# EAGLE design Reflow_triac_page1 (EAGLE 6.5.0)
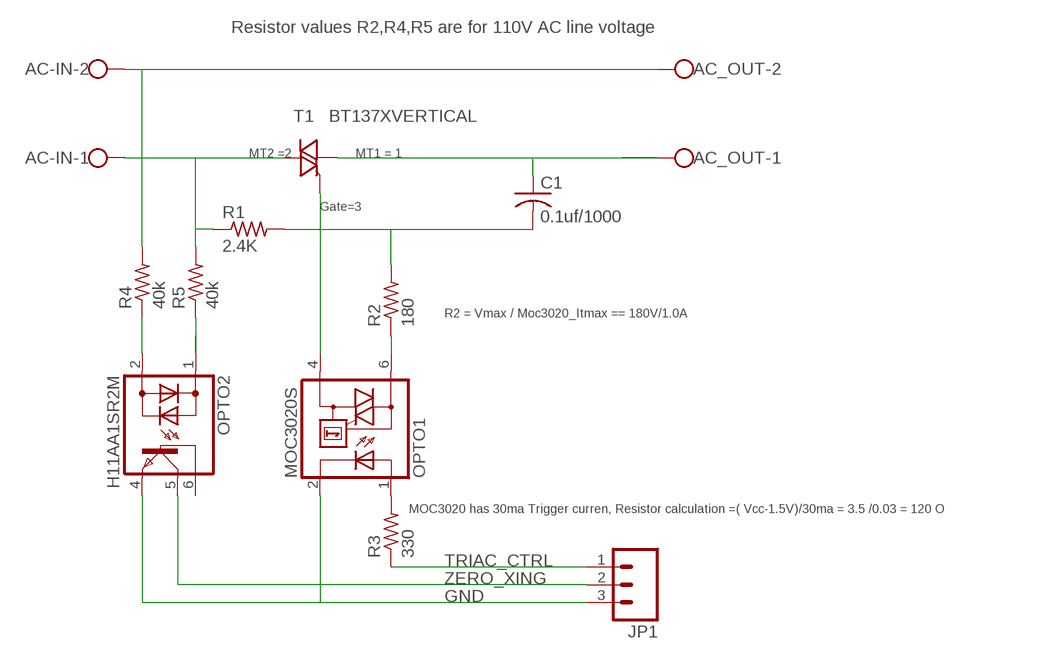
[diagram p0: schematic, sheet 1]

## Parts
AC-IN  W237-102  [W237-102]
AC_OUT  W237-102  [W237-102]
C1  0.1uf/1000  C-US102_152-062X184  [C102_152-062X184]
JP1  M03PTH  [1X03]
OPTO1  MOC3020S  MOC30MSMD  [DIL6-SMD]
OPTO2  H11AA1SR2M  IL250SMD  [DIL6-SMD]
R1  2.4K  R-US_0207/10  [0207/10]
R2  180  R-US_0207/10  [0207/10]
R3  330  R-US_0207/10  [0207/10]
R4  40k  R-US_0207/10  [0207/10]
R5  40k  R-US_0207/10  [0207/10]
T1  BT137XVERTICAL  [TO220DS]

## Nets
GND: JP1.3 OPTO1.2(C) OPTO2.4(E)
N$1: AC-IN.1 R1.1 R5.2 T1.A2
N$2: AC_OUT.1 C1.1 T1.A1
N$3: OPTO1.4(A1) T1.G
N$4: C1.2 R1.2 R2.2
N$5: OPTO1.6(A2) R2.1
N$6: OPTO1.1(A) R3.2
N$7: OPTO2.2(AC2) R4.1
N$8: AC-IN.2 AC_OUT.2 R4.2
N$9: OPTO2.1(AC1) R5.1
TRIAC_CTRL: JP1.1 R3.1
ZERO_XING: JP1.2 OPTO2.5(C)
Unconnected: OPTO2.6(B)

## Notes on the sheet
- Resistor values R2,R4,R5 are for 110V AC line voltage
- MT2 =2 | MT1 = 1
- Gate=3
- R2 = Vmax / Moc3020_Itmax == 180V/1.0A
- MOC3020 has 30ma Trigger curren, Resistor calculation =( Vcc-1.5V)/30ma = 3.5 /0.03 = 120 O

## Library data of the parts
AC-IN AC_OUT = con-wago-500:W237-102: WAGO SCREW CLAMP; MPN: 237-102; OC_FARNELL: unknown; OC_NEWARK: 70K9898
C1 = rcl:C-US: CAPACITOR, American symbol
JP1 = SparkFun-Connectors:M03: Header 3 Standard 3-pin 0.1" header. Use with straight break away headers (SKU : PRT-00116), right angle break away headers (PRT-00553), swiss pins (PRT-00743), machine pins (PRT-00117), and female headers (PRT-00115). Molex polarized connector foot print use with SKU : PRT-08232 with associated crimp pins and housings.
OPTO1 = optocoupler:MOC30*M: RANDOM-PHASE OPTOISOLATORS TRIAC DRIVER OUTPUT Source: http://www.fairchildsemi.com MOC3020-M.pdf
OPTO2 = optocoupler:IL250: SIEMENS OPTO COUPLER
R1-R5 = rcl:R-US_: RESISTOR, American symbol
T1 = triac:BT137X: 4 Quadrant Triac -600 600V

## Board
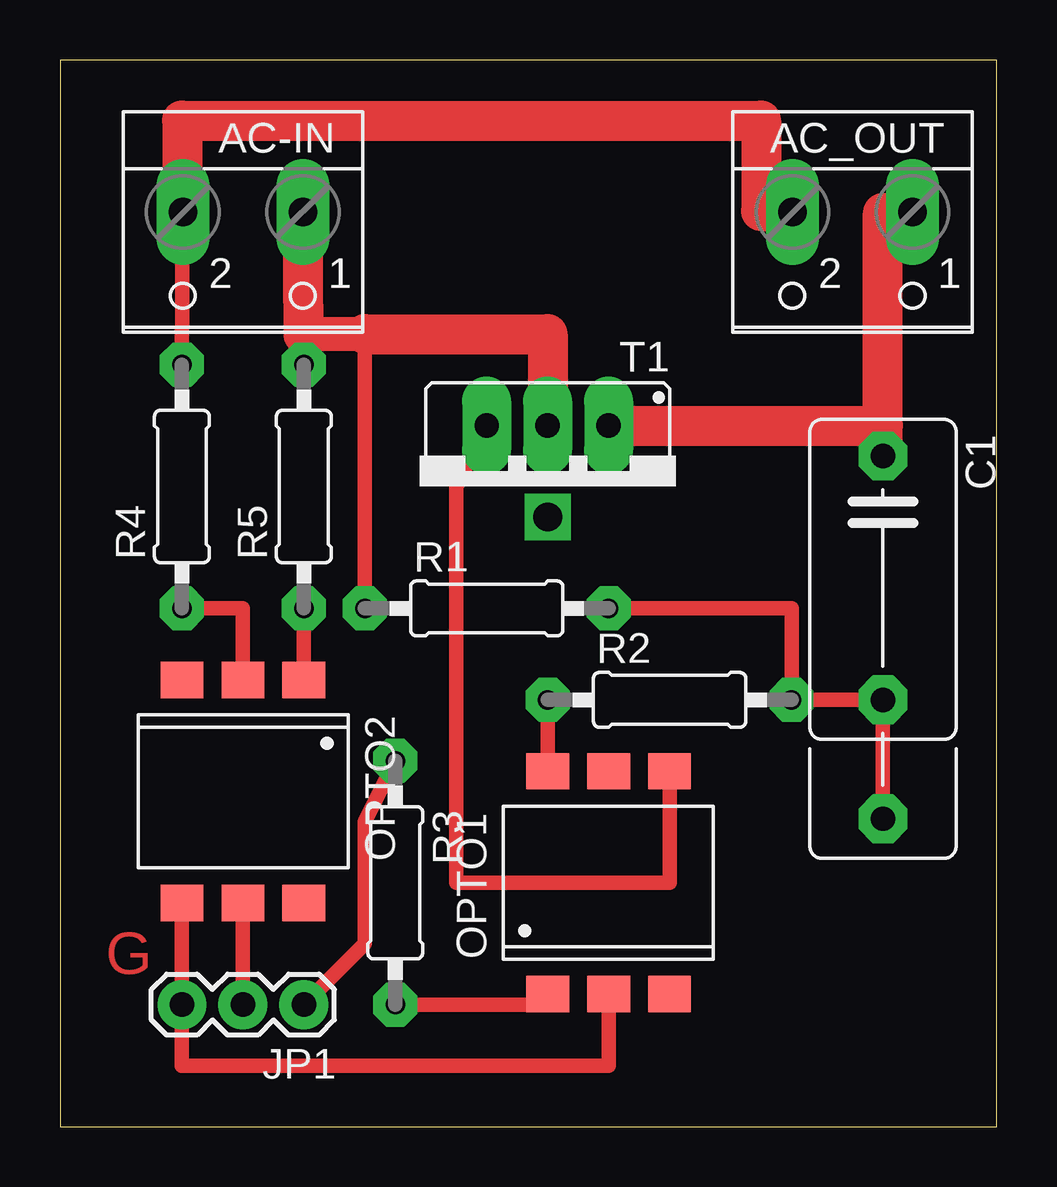
[diagram p1: board, top side]

Size 39.04 x 44.44 mm. Coordinates in mm from the lower left corner, seen from the top.
Outline: 0,0 39.04,0 39.04,44.44 0,44.44 0,0
Copper layers (1*16): Top 0.035mm / dielectric 1.5mm / Bottom 0.035mm
Design rules "default *": minimum track width 10mil, minimum drill 24mil, track to track 8mil, track to pad 8mil, pad to pad 8mil, via to via 8mil, smd to smd 8mil, copper to edge 40mil, drill to drill 8mil, minimum pad ring 20mil, minimum via ring 8mil, stop-mask expansion 4mil, vias tented up to drill 0mil, thermal gap 10mil

### Footprints (pad centres in the part's own frame; a part is rotated, then mirrored left to right if it is on the bottom)
W237-102 = drill 1.194 long: 1 -2.5,-1.27; 2 2.5,-1.27
C102_152-062X184 = drill 1.016 octagon: 1 -5.08,0; 2 5.08,0; 3 10.033,0
1X03 = drill 1.016 pad 1.88: 1 0,0; 2 2.54,0; 3 5.08,0
DIL6-SMD = smd 1.78 x 1.52: 1 -2.54,-4.645; 2 0,-4.645; 3 2.54,-4.645; 4 2.54,4.645; 5 0,4.645; 6 -2.54,4.645
0207/10 = drill 0.813 octagon: 1 -5.08,0; 2 5.08,0
TO220DS = drill 1.016 long: A1 -2.54,-2.54; A2 0,-2.54; G 2.54,-2.54

### Placement (x,y rotation side)
AC-IN  7.62,36.83 180 top
AC_OUT  33.02,36.83 180 top
C1  34.29,22.86 270 top
JP1  10.16,5.08 180 top
OPTO1  22.86,10.16 0 top
OPTO2  7.62,13.97 180 top
R1  17.78,21.59 0 top
R2  25.4,17.78 0 top
R3  13.97,10.16 270 top
R4  5.08,26.67 90 top
R5  10.16,26.67 90 top
T1  20.32,26.67 180 top

### Tracks (layer width: path | path; a pad name or v marks a point on that pad's centre or on a via)
GND
  Top 0.406: OPTO1.2 22.86,3.81
  Top 0.61: OPTO2.4 JP1.3 5.08,2.54 22.86,2.54 OPTO1.2
N$1
  Top 0.61: R1.1 12.7,33.02
  Top 1.27: R5.2 10.15,33.01
  Top 1.422: 12.7,33.02 10.15,33.01
  Top 1.676: 10.15,33.01 AC-IN.1 | 12.7,33.02 20.32,33.02 T1.A2
N$2
  Top 1.27: 34.29,29.21 C1.1
  Top 1.676: T1.A1 34.29,29.21 | C1.1 34.29,38.06 AC_OUT.1
N$3
  Top 0.61: OPTO1.4 25.4,10.16 16.51,10.16 16.51,26.67 T1.G
N$4
  Top 0.61: R1.2 30.48,21.59 R2.2 C1.2 34.29,12.7
N$5
  Top 0.61: OPTO1.6 R2.1
N$6
  Top 0.406: 19.89,5.08 OPTO1.1
  Top 0.61: R3.2 19.89,5.08
N$7
  Top 0.61: R4.1 7.62,21.59 OPTO2.2
N$8
  Top 0.406: 5.12,41.87 5.08,41.91
  Top 0.61: R4.2 AC-IN.2
  Top 1.676: AC-IN.2 5.12,41.87 | 5.08,41.91 29.21,41.91 29.21,38.14 AC_OUT.2
N$9
  Top 0.61: R5.1 OPTO2.1
N$11  (via drill 1.2 pad 1.93)
  other vias: 20.32,25.4
TRIAC_CTRL
  Top 0.61: R3.1 12.7,12.7 12.7,7.62 JP1.1
ZERO_XING
  Top 0.61: OPTO2.5 JP1.2

### Text on the board
Top: G